# EAGLE schematic Expansion_Card (EAGLE 9.6.2)
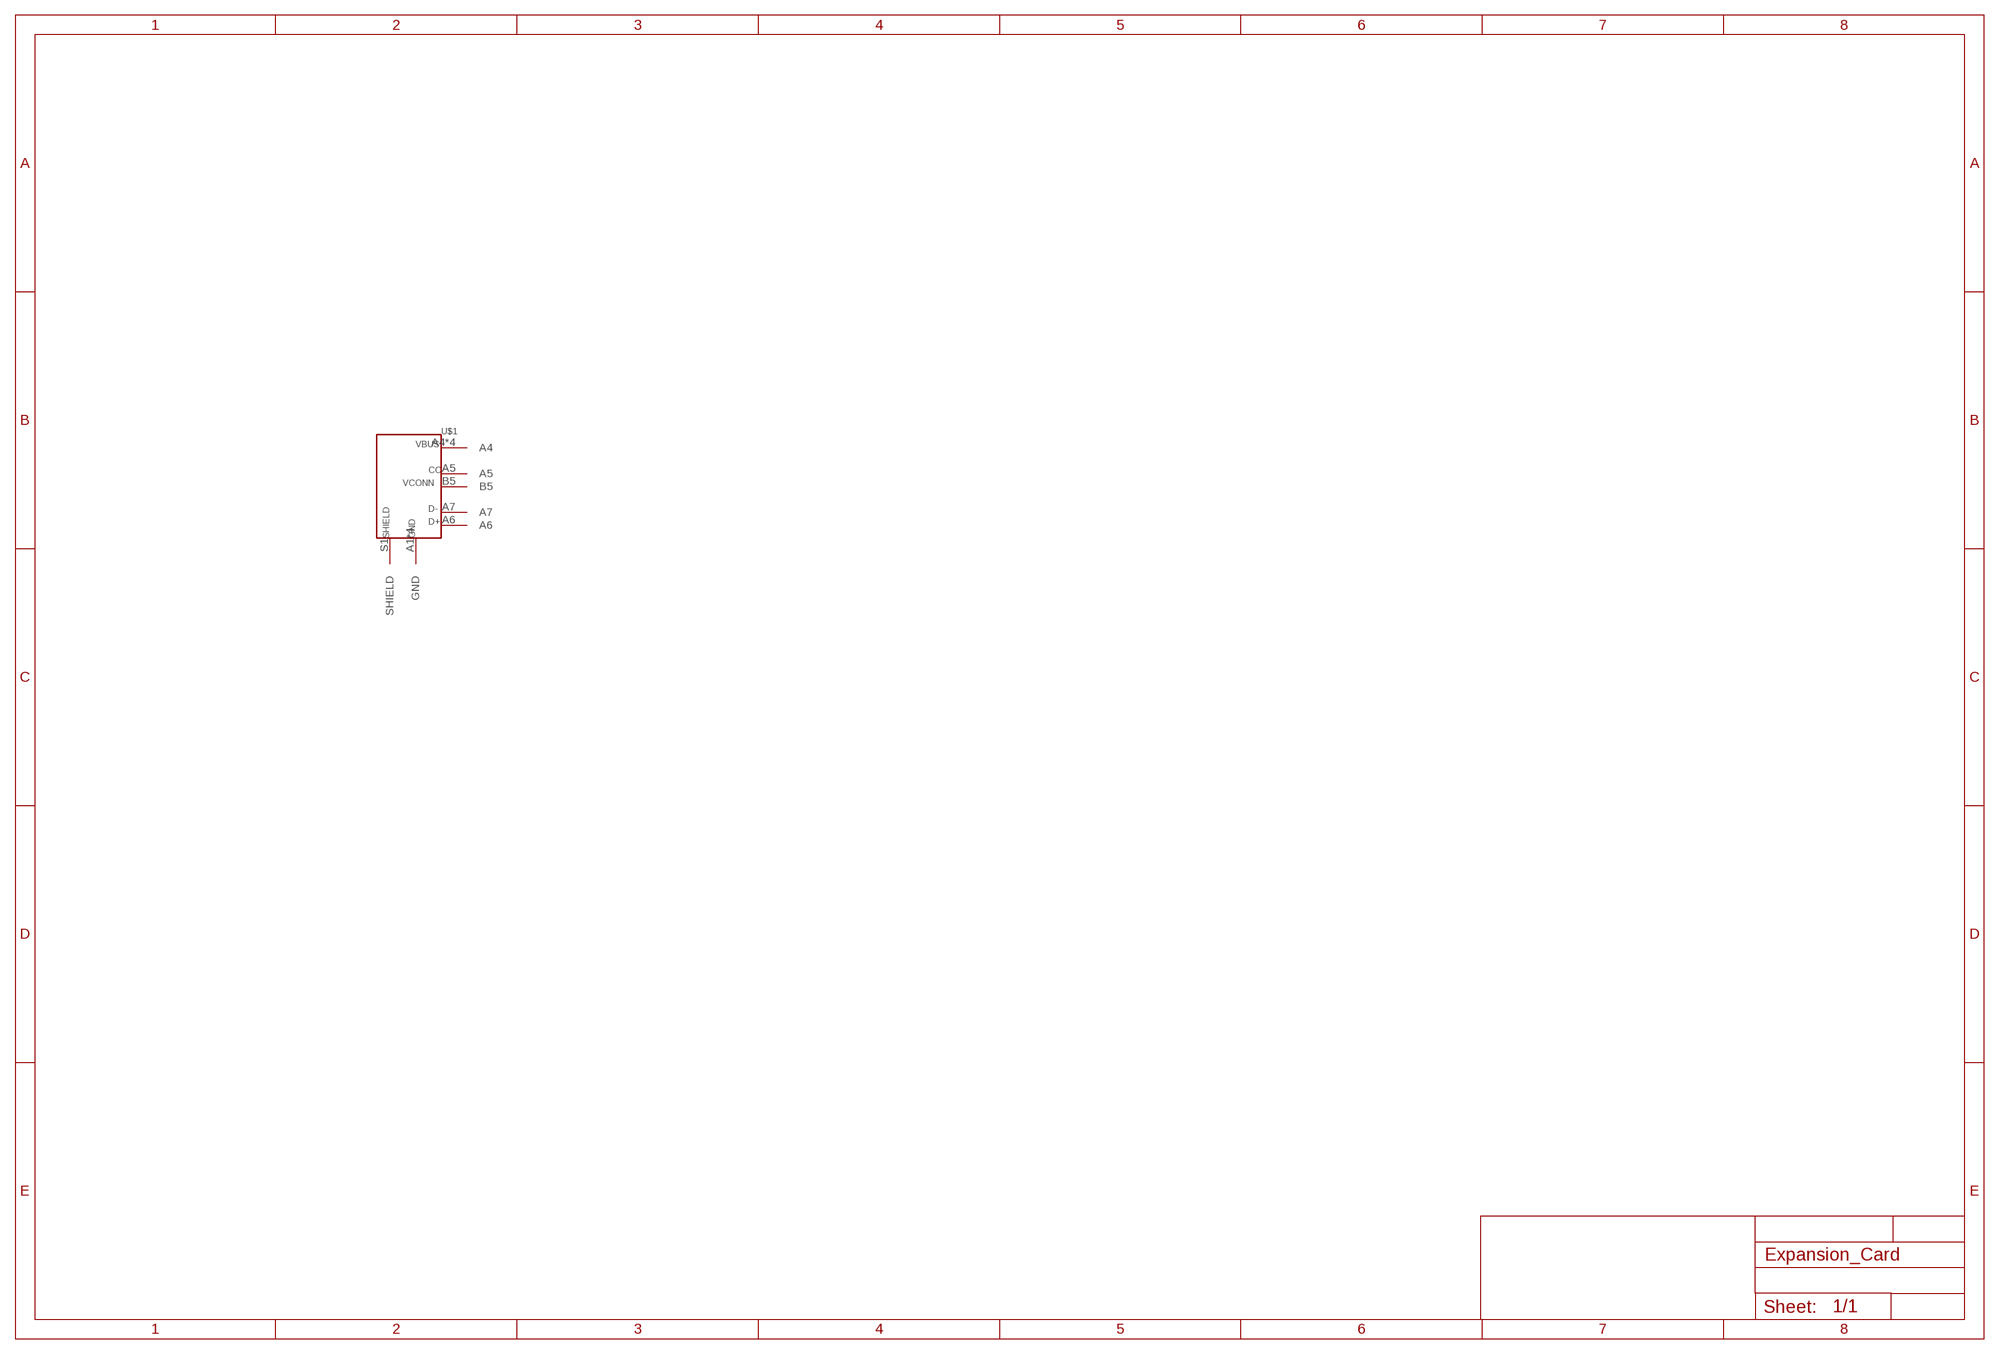
[diagram p0: schematic, sheet 1]

## Parts
U$1  USB-C_MOLEX105444  [EDGE_MOUNT]
Unconnected: U$1.A1(GND) U$1.A4 U$1.A5 U$1.A6 U$1.A7 U$1.A9(A4) U$1.A12(GND) U$1.B1(GND) U$1.B4(A4) U$1.B5 U$1.B9(A4) U$1.B12(GND) U$1.S1(SHIELD)

## Library data of the parts
U$1 = Framework_components:USB-C; MOLEX: 105444